# Altium project 8 Motors.PrjPcb (part 1 of 2)
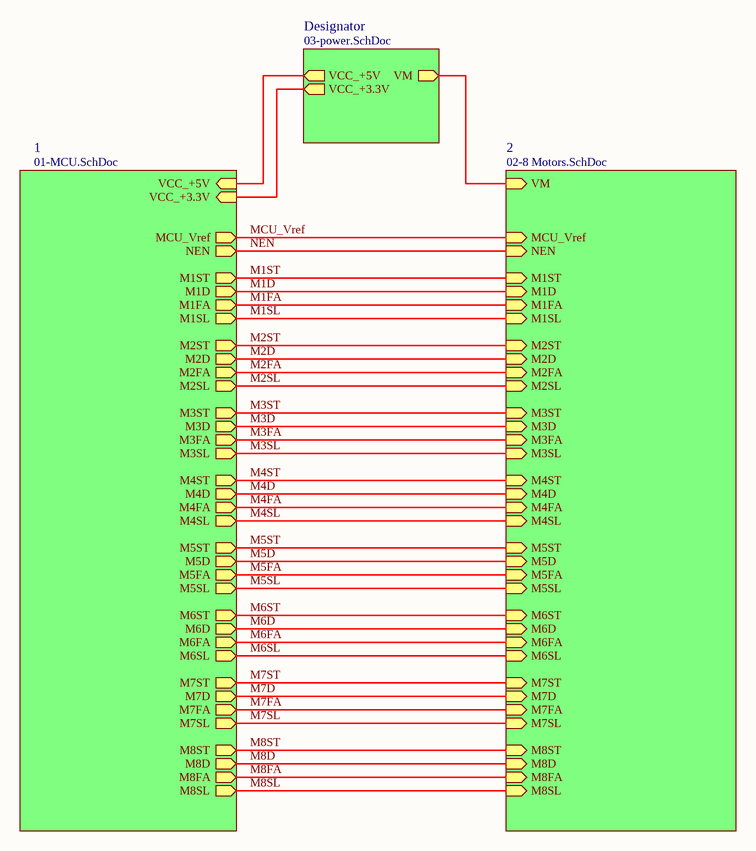
[diagram p0: 00-Main.SchDoc]
4 sheets, 196 parts. Net scope: hierarchical (ports join the sheet entries above them; power ports are global).
Board file: 8 Motors.PcbDoc
Sheets:
  00-Main.SchDoc
    1 = 01-MCU.SchDoc
    2 = 02-8 Motors.SchDoc
    Designator = 03-power.SchDoc

## Sheet 00-Main.SchDoc
size A4

### Sub-sheets
1 = 01-MCU.SchDoc: M1ST (out), M1D (out), M1FA (out), M1SL (out), NEN (out), M2ST (out), M2D (out), M2FA (out), M2SL (out), M3ST (out), M3D (out), M3FA (out), M3SL (out), M4ST (out), M4D (out), M4FA (out), M4SL (out), M5ST (out), M5D (out), M5FA (out), M5SL (out), M6ST (out), M6D (out), M6FA (out), M6SL (out), M7ST (out), M7D (out), M7FA (out), M7SL (out), M8ST (out), M8D (out), M8FA (out), M8SL (out), MCU_Vref (out), VCC_+5V (in), VCC_+3.3V (in)
2 = 02-8 Motors.SchDoc: M1ST (in), M1D (in), M1FA (in), M1SL (in), NEN (in), M2ST (in), M2D (in), M2FA (in), M2SL (in), M3ST (in), M3D (in), M3FA (in), M3SL (in), M4ST (in), M4D (in), M4FA (in), M4SL (in), M5ST (in), M5D (in), M5FA (in), M5SL (in), M6ST (in), M6D (in), M6FA (in), M6SL (in), M7ST (in), M7D (in), M7FA (in), M7SL (in), M8ST (in), M8D (in), M8FA (in), M8SL (in), MCU_Vref (in), VM (in)
Designator = 03-power.SchDoc: VCC_+5V (out), VCC_+3.3V (out), VM (out)

### Nets
VCC_+3.3V: sheet 1/VCC_+3.3V, sheet Designator/VCC_+3.3V
VCC_+5V: sheet 1/VCC_+5V, sheet Designator/VCC_+5V
VM: sheet 2/VM, sheet Designator/VM
M1D: sheet 1/M1D, sheet 2/M1D
M1FA: sheet 1/M1FA, sheet 2/M1FA
M1SL: sheet 1/M1SL, sheet 2/M1SL
M1ST: sheet 1/M1ST, sheet 2/M1ST
M2D: sheet 1/M2D, sheet 2/M2D
M2FA: sheet 1/M2FA, sheet 2/M2FA
M2SL: sheet 1/M2SL, sheet 2/M2SL
M2ST: sheet 1/M2ST, sheet 2/M2ST
M3D: sheet 1/M3D, sheet 2/M3D
M3FA: sheet 1/M3FA, sheet 2/M3FA
M3SL: sheet 1/M3SL, sheet 2/M3SL
M3ST: sheet 1/M3ST, sheet 2/M3ST
M4D: sheet 1/M4D, sheet 2/M4D
M4FA: sheet 1/M4FA, sheet 2/M4FA
M4SL: sheet 1/M4SL, sheet 2/M4SL
M4ST: sheet 1/M4ST, sheet 2/M4ST
M5D: sheet 1/M5D, sheet 2/M5D
M5FA: sheet 1/M5FA, sheet 2/M5FA
M5SL: sheet 1/M5SL, sheet 2/M5SL
M5ST: sheet 1/M5ST, sheet 2/M5ST
M6D: sheet 1/M6D, sheet 2/M6D
M6FA: sheet 1/M6FA, sheet 2/M6FA
M6SL: sheet 1/M6SL, sheet 2/M6SL
M6ST: sheet 1/M6ST, sheet 2/M6ST
M7D: sheet 1/M7D, sheet 2/M7D
M7FA: sheet 1/M7FA, sheet 2/M7FA
M7SL: sheet 1/M7SL, sheet 2/M7SL
M7ST: sheet 1/M7ST, sheet 2/M7ST
M8D: sheet 1/M8D, sheet 2/M8D
M8FA: sheet 1/M8FA, sheet 2/M8FA
M8SL: sheet 1/M8SL, sheet 2/M8SL
M8ST: sheet 1/M8ST, sheet 2/M8ST
MCU_Vref: sheet 1/MCU_Vref, sheet 2/MCU_Vref
NEN: sheet 1/NEN, sheet 2/NEN

## Sheet 01-MCU.SchDoc
size A3
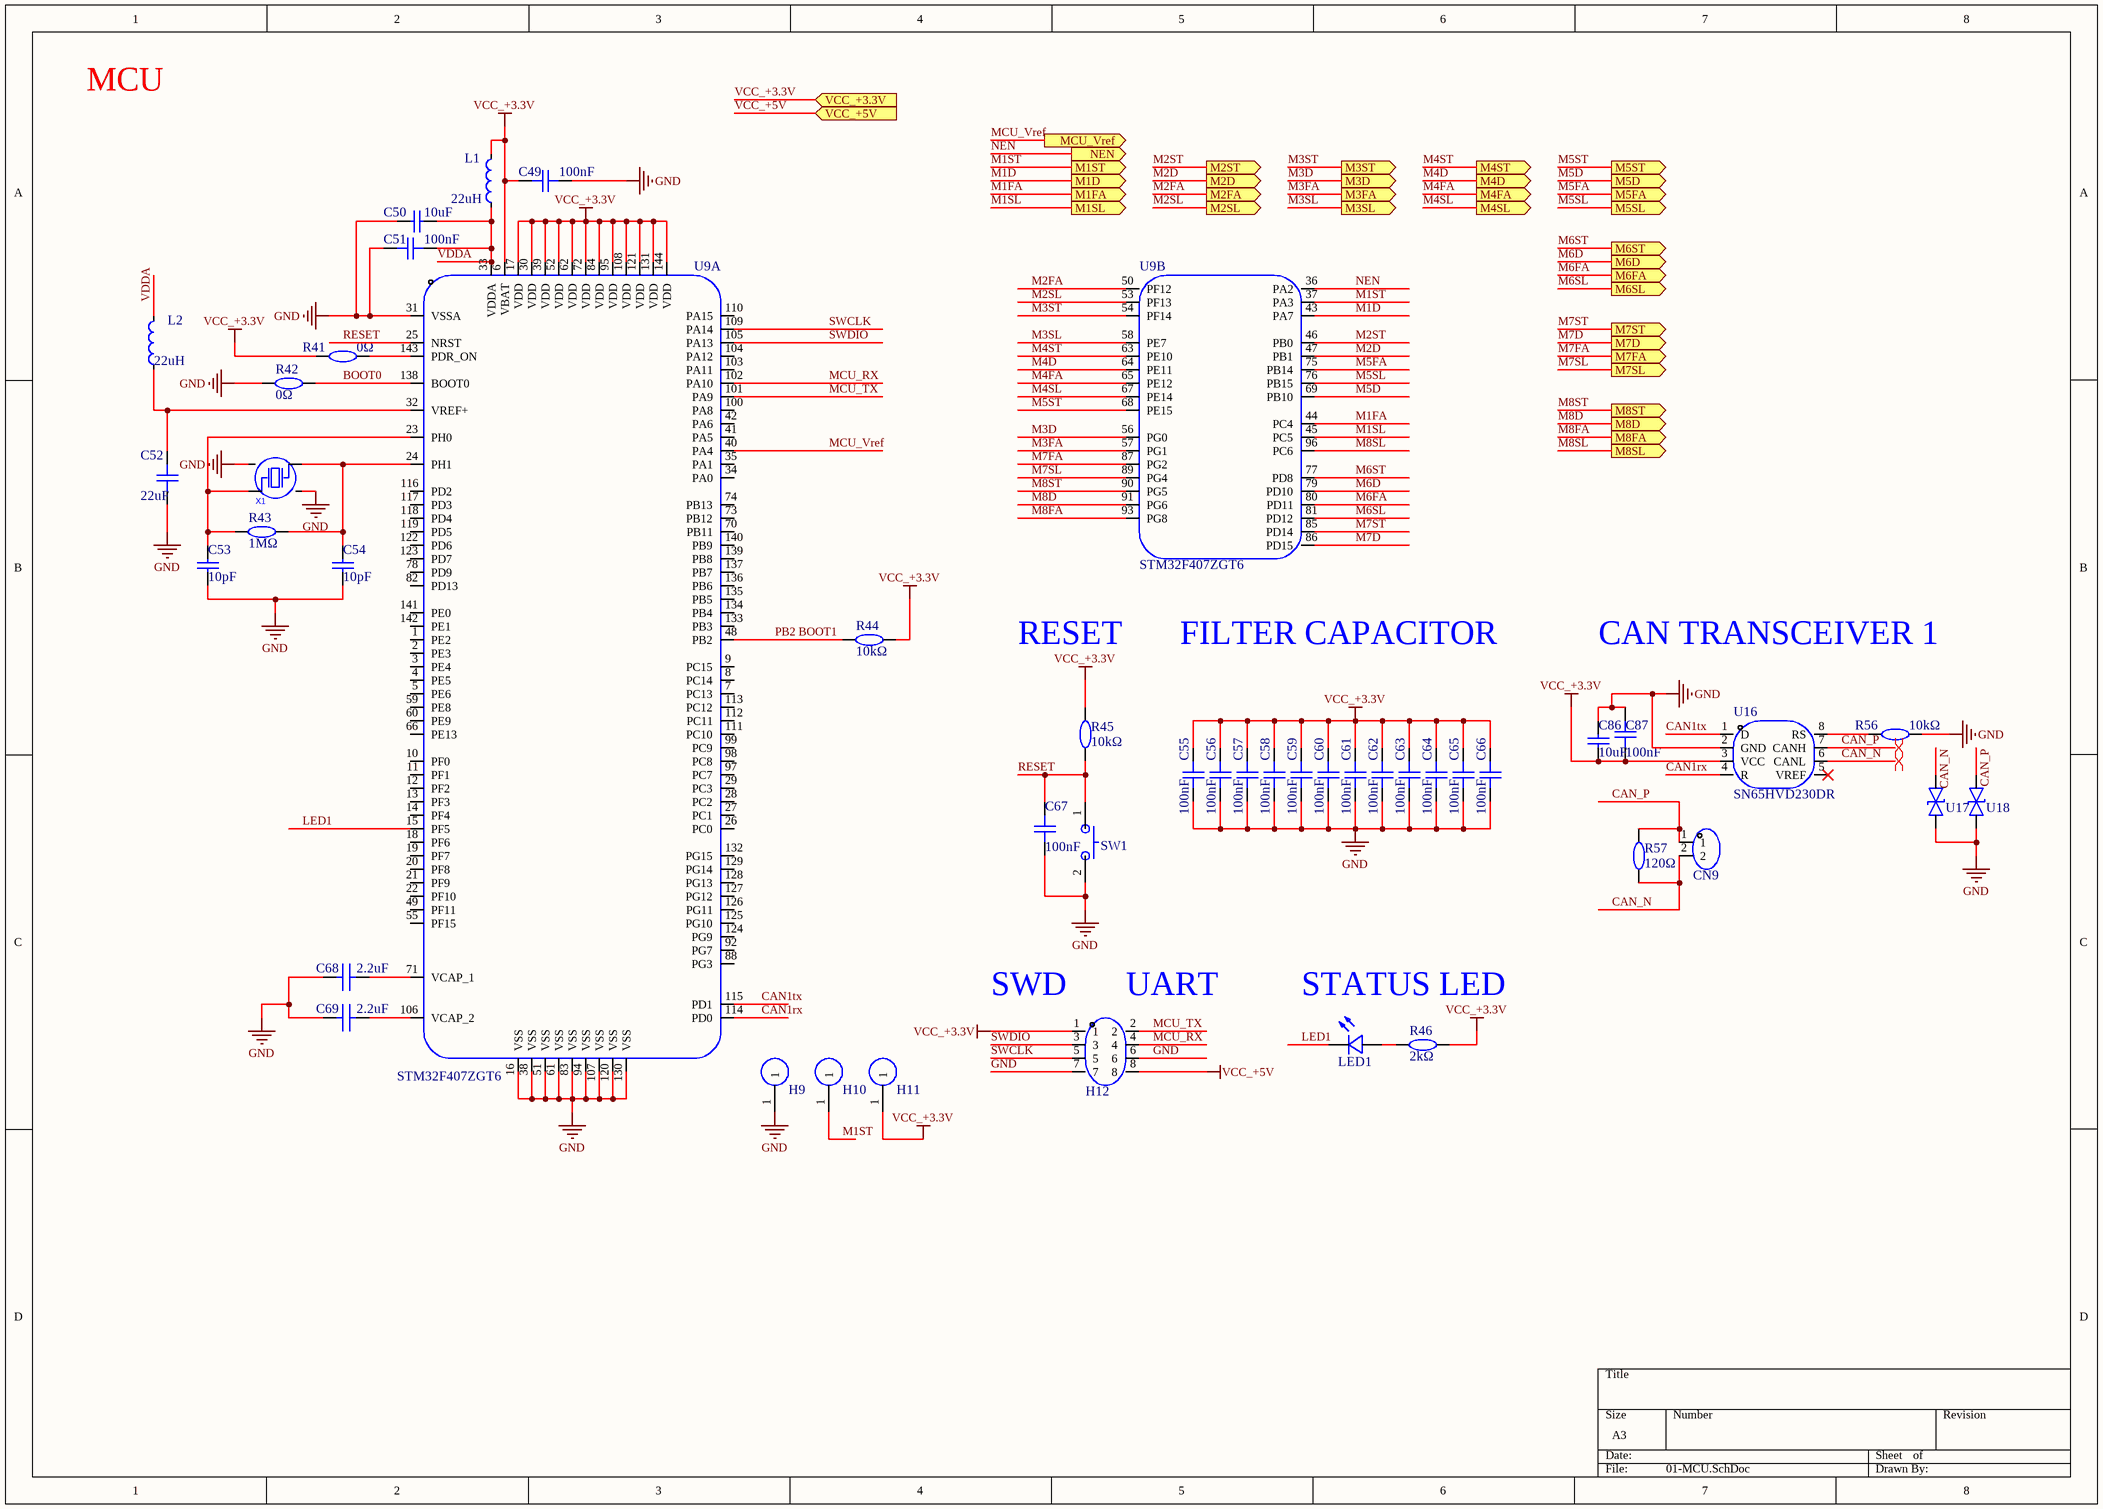
[diagram p1: 01-MCU.SchDoc]

### Parts
C49  100nF  [C0402_2.2uF]
C50  10uF  [C0402_2.2uF]
C51  100nF  [C0402_2.2uF]
C52  22uF  [C0603]
C53  10pF  [C0402_2.2uF]
C54  10pF  [C0402_2.2uF]
C55  100nF  [C0402_2.2uF]
C56  100nF  [C0402_2.2uF]
C57  100nF  [C0402_2.2uF]
C58  100nF  [C0402_2.2uF]
C59  100nF  [C0402_2.2uF]
C60  100nF  [C0402_2.2uF]
C61  100nF  [C0402_2.2uF]
C62  100nF  [C0402_2.2uF]
C63  100nF  [C0402_2.2uF]
C64  100nF  [C0402_2.2uF]
C65  100nF  [C0402_2.2uF]
C66  100nF  [C0402_2.2uF]
C67  100nF  [C0603]
C68  2.2uF  [C0402_2.2uF]
C69  2.2uF  [C0402_2.2uF]
C86  10uF  [C0402_2.2uF]
C87  100nF  [C0402_2.2uF]
CN9  ZX-XH2.54-2PZZ  [ZX-XH2.54-2PZZ]  (value not drawn)
H9  PZ254V-11-01P  [Testpoint]  (value not drawn)
H10  PZ254V-11-01P  [Testpoint]  (value not drawn)
H11  PZ254V-11-01P  [Testpoint]  (value not drawn)
H12  PZ254V-12-8P  [HC-1.25-8PLT]  (value not drawn)
L1  22uH  [L0603_22uH]
L2  22uH  [L0603_22uH]
LED1  MHT192UGCT  [LED]  (value not drawn)
R41  0Ω  [R0603]
R42  0Ω  [R0603]
R43  1MΩ  [R0603]
R44  10kΩ  [R0603_10KΩ]
R45  10kΩ  [R0603_10KΩ]
R46  2kΩ  [R0603]
R56  10kΩ  [R0603]
R57  120Ω  [R0603]
SW1  GT-TC029B-H020-L1N  [Switch]  (value not drawn)
U9  STM32F407ZGT6  [STM32F407ZGT6]  (parts A,B of 2)
U16  SN65HVD230DR  [SN65HVD230DR]
U17  PESD0603-240  [PESD0603-240]  (value not drawn)
U18  PESD0603-240  [PESD0603-240]  (value not drawn)
X1  8MHz  [Osc_8M]  (value not drawn)

### Ports
M1D (out), M1FA (out), M1SL (out), M1ST (out), M2D (out), M2FA (out), M2SL (out), M2ST (out), M3D (out), M3FA (out), M3SL (out), M3ST (out), M4D (out), M4FA (out), M4SL (out), M4ST (out), M5D (out), M5FA (out), M5SL (out), M5ST (out), M6D (out), M6FA (out), M6SL (out), M6ST (out), M7D (out), M7FA (out), M7SL (out), M7ST (out), M8D (out), M8FA (out), M8SL (out), M8ST (out), MCU_Vref (out), NEN (out), VCC_+3.3V (in), VCC_+5V (in)

### Nets
GND: C49.2 C50.1 C51.1 C52.1 C53.1 C54.1 C55.2 C56.2 C57.2 C58.2 C59.2 C60.2 C61.2 C62.2 C63.2 C64.2 C65.2 C66.2 C67.1 C68.1 C69.1 C86.2 C87.2 H9.1 H12.6 H12.7 R42.1 R56.2 SW1.2 U9.16(VSS) U9.31(VSSA) U9.38(VSS) U9.51(VSS) U9.61(VSS) U9.83(VSS) U9.94(VSS) U9.107(VSS) U9.120(VSS) U9.130(VSS) U16.2(GND) U17.1 U18.1 X1.2 X1.4
VCC_+3.3V: C49.1 C55.1 C56.1 C57.1 C58.1 C59.1 C60.1 C61.1 C62.1 C63.1 C64.1 C65.1 C66.1 C86.1 C87.1 H11.1 H12.1 L1.2 R41.1 R44.2 R45.2 R46.2 U9.6(VBAT) U9.17(VDD) U9.30(VDD) U9.39(VDD) U9.52(VDD) U9.62(VDD) U9.72(VDD) U9.84(VDD) U9.95(VDD) U9.108(VDD) U9.121(VDD) U9.131(VDD) U9.144(VDD) U16.3(VCC) ; port VCC_+3.3V
VCC_+5V: H12.8 ; port VCC_+5V
BOOT0: R42.2 U9.138(BOOT0)
CAN1rx: U9.114(PD0) U16.4(R)
CAN1tx: U9.115(PD1) U16.1(D)
CAN_N: CN9.2 R57.1 U16.6(CANL) U17.2
CAN_P: CN9.1 R57.2 U16.7(CANH) U18.2
LED1: LED1.1(-) U9.15(PF5)
M1D: U9.43(PA7) ; port M1D
M1FA: U9.44(PC4) ; port M1FA
M1SL: U9.45(PC5) ; port M1SL
M1ST: H10.1 U9.37(PA3) ; port M1ST
M2D: U9.47(PB1) ; port M2D
M2FA: U9.50(PF12) ; port M2FA
M2SL: U9.53(PF13) ; port M2SL
M2ST: U9.46(PB0) ; port M2ST
M3D: U9.56(PG0) ; port M3D
M3FA: U9.57(PG1) ; port M3FA
M3SL: U9.58(PE7) ; port M3SL
M3ST: U9.54(PF14) ; port M3ST
M4D: U9.64(PE11) ; port M4D
M4FA: U9.65(PE12) ; port M4FA
M4SL: U9.67(PE14) ; port M4SL
M4ST: U9.63(PE10) ; port M4ST
M5D: U9.69(PB10) ; port M5D
M5FA: U9.75(PB14) ; port M5FA
M5SL: U9.76(PB15) ; port M5SL
M5ST: U9.68(PE15) ; port M5ST
M6D: U9.79(PD10) ; port M6D
M6FA: U9.80(PD11) ; port M6FA
M6SL: U9.81(PD12) ; port M6SL
M6ST: U9.77(PD8) ; port M6ST
M7D: U9.86(PD15) ; port M7D
M7FA: U9.87(PG2) ; port M7FA
M7SL: U9.89(PG4) ; port M7SL
M7ST: U9.85(PD14) ; port M7ST
M8D: U9.91(PG6) ; port M8D
M8FA: U9.93(PG8) ; port M8FA
M8SL: U9.96(PC6) ; port M8SL
M8ST: U9.90(PG5) ; port M8ST
MCU_RX: H12.4 U9.102(PA10)
MCU_TX: H12.2 U9.101(PA9)
MCU_Vref: U9.40(PA4) ; port MCU_Vref
NEN: U9.36(PA2) ; port NEN
PB2 BOOT1: R44.1 U9.48(PB2)
RESET: C67.2 R45.1 SW1.1 U9.25(NRST)
SWCLK: H12.5 U9.109(PA14)
SWDIO: H12.3 U9.105(PA13)
VDDA: C50.2 C51.2 L1.1 L2.2 U9.33(VDDA)
NetC52_2: C52.2 L2.1 U9.32(VREF+)
NetC53_2: C53.2 R43.1 U9.23(PH0) X1.1
NetC54_2: C54.2 R43.2 U9.24(PH1) X1.3
NetC68_2: C68.2 U9.71(VCAP_1)
NetC69_2: C69.2 U9.106(VCAP_2)
NetLED1_2: LED1.2(+) R46.1
NetR41_2: R41.2 U9.143(PDR_ON)
NetR56_1: R56.1 U16.8(RS)

Not connected (* = marked no-connect by the designer): U9 1(PE2) 2(PE3) 3(PE4) 4(PE5) 5(PE6) 7(PC13) 8(PC14) 9(PC15) 10(PF0) 11(PF1) 12(PF2) 13(PF3) 14(PF4) 18(PF6) 19(PF7) 20(PF8) 21(PF9) 22(PF10) 26(PC0) 27(PC1) 28(PC2) 29(PC3) 34(PA0) 35(PA1) 41(PA5) 42(PA6) 49(PF11) 55(PF15) 59(PE8) 60(PE9) 66(PE13) 70(PB11) 73(PB12) 74(PB13) 78(PD9) 82(PD13) 88(PG3) 92(PG7) 97(PC7) 98(PC8) 99(PC9) 100(PA8) 103(PA11) 104(PA12) 110(PA15) 111(PC10) 112(PC11) 113(PC12) 116(PD2) 117(PD3) 118(PD4) 119(PD5) 122(PD6) 123(PD7) 124(PG9) 125(PG10) 126(PG11) 127(PG12) 128(PG13) 129(PG14) 132(PG15) 133(PB3) 134(PB4) 135(PB5) 136(PB6) 137(PB7) 139(PB8) 140(PB9) 141(PE0) 142(PE1); U16 5(VREF)*

### Layout directives
differential pair: CAN_N, CAN_P

### Notes on the sheet
- MCU
- RESET
- FILTER CAPACITOR
- CAN TRANSCEIVER 1
- (near H12) SWD
- (near H12) UART
- STATUS LED

### Library data of the parts
C49 C51 C55-C66 C87 = C0402_100nF: 0402电容; Manufacturer: muRata(村田); Symbol: GRM155R71H104KE14D; Add into BOM: yes; Tolerance: ±10%; Voltage Rated: 50V; Temperature Coefficient: X7R; Device: GRM155R71H104KE14D; LCSC Part Name: 100nF ±10% 50V; Supplier Part: C77020; Manufacturer Part: GRM155R71H104KE14D; Supplier Footprint: 0402; JLCPCB Part Class: Extended Part; Datasheet: https://atta.szlcsc.com/upload/public/pdf/source/20180326/C77020_39BD49C951FF1AF0DB1F1FAC5AC1E401.pdf; Supplier: LCSC; Convert to PCB: yes; Value: 100nF; Comment_1: 100nF
C50 C86 = C0402_10uF: 0402电容; Manufacturer: SAMSUNG(三星); Symbol: CL05A106MQ5NUNC; Add into BOM: yes; Tolerance: ±20%; Voltage Rated: 6.3V; Temperature Coefficient: X5R; Device: CL05A106MQ5NUNC; LCSC Part Name: 10uF ±20% 6.3V; Supplier Part: C15525; Manufacturer Part: CL05A106MQ5NUNC; Supplier Footprint: 0402; JLCPCB Part Class: Basic Part; Datasheet: https://atta.szlcsc.com/upload/public/pdf/source/20220823/2B02EE04F8F211D38A52DCB16EB6BEBA.pdf; Supplier: LCSC; Convert to PCB: yes; Value: 10uF; Comment_1: 10uF
C52 = C0603_22uF: 0603电容; Manufacturer: SAMSUNG(三星); Symbol: CC0603KRX7R9BB104; Add into BOM: yes; Tolerance: ±20%; Voltage Rated: 16V; Temperature Coefficient: X5R; Name: 22uF; Device: CC0603KRX7R9BB104; LCSC Part Name: 22uF ±20% 16V; Supplier Part: C6119868; Manufacturer Part: CC0603KRX7R9BB104; Supplier Footprint: 0603; JLCPCB Part Class: Basic Part; Datasheet: https://atta.szlcsc.com/upload/public/pdf/source/20180910/C282072_33301C7F631E79921B82A8DAC6BCC5B3.pdf; Supplier: LCSC; Convert to PCB: yes; Value: 22uF
C53 C54 = C0402_10pF: 0402电容; Manufacturer: FH(风华); Symbol: 0402CG100J500NT; Add into BOM: yes; Tolerance: ±5%; Voltage Rated: 50V; Temperature Coefficient: C0G; Device: 0402CG100J500NT; LCSC Part Name: 10pF ±5% 50V; Supplier Part: C1545; Manufacturer Part: 0402CG100J500NT; Supplier Footprint: 0402; JLCPCB Part Class: Extended Part; Datasheet: https://atta.szlcsc.com/upload/public/pdf/source/20200305/C486355_26A10D38EF8C2A5C37091D0039909270.pdf; Supplier: LCSC; Convert to PCB: yes; Value: 10pF; Comment_1: 10pF
C67 = C0603_100nF: 0603电容; Manufacturer: SAMSUNG(三星); Symbol: CC0603KRX7R9BB104; Add into BOM: yes; Tolerance: ±10%; Voltage Rated: 50V; Temperature Coefficient: X7R; Name: 100nF; Device: CC0603KRX7R9BB104; LCSC Part Name: 100nF ±10% 50V; Supplier Part: C6119867; Manufacturer Part: CC0603KRX7R9BB104; Supplier Footprint: 0603; JLCPCB Part Class: Basic Part; Datasheet: https://atta.szlcsc.com/upload/public/pdf/source/20180910/C282072_33301C7F631E79921B82A8DAC6BCC5B3.pdf; Supplier: LCSC; Convert to PCB: yes; Value: 100nF
C68 C69 = C0402_2.2uF: 容值 2.2uF   精度 ±20%   额定电压 6.3V   材质(温度系数) X5R; Manufacturer: SAMSUNG(三星); Symbol: CL05A225MQ5NSNC; Add into BOM: yes; Device: CL05A225MQ5NSNC; LCSC Part Name: 2.2uF ±20% 6.3V; Supplier Part: C12530; Manufacturer Part: CL05A225MQ5NSNC; Supplier Footprint: 0402; JLCPCB Part Class: Basic Part; Datasheet: https://atta.szlcsc.com/upload/public/pdf/source/20160218/1457707763339.pdf; Supplier: LCSC; Convert to PCB: yes; Value: 2.2uF; Tolerance: ±20%; Voltage Rated: 6.3V; Temperature Coefficient: X5R; Comment_1: 2.2uF
CN9 = ZX-XH2.54-2PZZ: 直插插针; Manufacturer: Megastar(兆星); Add into BOM: yes; Pins Structure: 1x2P; Pitch: 2.54mm; Reference Series: XH; Number of PINs Per Row: 2; Current Rating (Max): 3A; Symbol: ZX-XH2.54-2PZZ; Device: ZX-XH2.54-2PZZ; LCSC Part Name: ZX-XH2.54-2PZZ; Supplier Part: C7429632; Manufacturer Part: ZX-XH2.54-2PZZ; Supplier Footprint: 插件,P=2.54mm; JLCPCB Part Class: Extended Part; Datasheet: https://atta.szlcsc.com/upload/public/pdf/source/20230619/19BA6947230AA44A04D3EDD65E618FD0.pdf; Supplier: LCSC; Convert to PCB: yes; Mounting Style: 直插; Number of Pins: 2P; Number of Rows: 1; Row Spacing: -; Contact Material: 黄铜; Contact Plating: 锡; Operating Temperature Range: -25℃~+85℃; Comment_1: ZX-XH2.54-2PZZ
H9-H11 = Testpoint: 测试点; Manufacturer: XFCN(兴飞); Add into BOM: yes; Pin Structure: 1x1P; Pitch: 2.54mm; Circluar Pins/Square Pins: 方针; Symbol: PZ254V-11-01P; Device: PZ254V-11-01P; LCSC Part Name: 间距:2.54mm 1x1P 直插 方针; Supplier Part: C492400; Manufacturer Part: PZ254V-11-01P; Supplier Footprint: 插件,P=2.54mm; JLCPCB Part Class: Extended Part; Datasheet: https://atta.szlcsc.com/upload/public/pdf/source/20200309/C492400_46876A5B545F5AE6B8D4A09C46E276E8.pdf; Supplier: LCSC; Convert to PCB: yes; Row Spacing: -; Mounting Type: 直插; Number of Rows: 单排; Number of Pins: 1P; Current Rating (Max): -; Voltage Rating (Max): -; Length of Mating Pin: 6mm; Insulation Height: 2.5mm; Length of End Connection Pin: 3mm; Contact Material: 黄铜; Contact Plating: -; Operating Temperature Range: -40℃~+105℃; Color: 黑色; Comment_1: PZ254V-11-01P
H12 = HC-1.25-8PLT: 排针8P; Manufacturer: XFCN(兴飞); Add into BOM: yes; Pin Structure: 2x4P; Pitch: 2.54mm; Circluar Pins/Square Pins: 方针; Symbol: PZ254V-12-8P; Device: PZ254V-12-8P; LCSC Part Name: 间距:2.54mm 2x4P 直插 方针; Supplier Part: C492421; Manufacturer Part: PZ254V-12-8P; Supplier Footprint: 插件,P=2.54mm; JLCPCB Part Class: Extended Part; Datasheet: https://atta.szlcsc.com/upload/public/pdf/source/20200309/C492421_DC8A206AF99CD7755BD4A5B0BC48200B.pdf; Supplier: LCSC; Convert to PCB: yes; Row Spacing: 2.54mm; Mounting Type: 直插; Number of Rows: 双排; Number of Pins: 8P; Current Rating (Max): -; Voltage Rating (Max): -; Length of Mating Pin: 6mm; Insulation Height: 2.5mm; Length of End Connection Pin: 3mm; Contact Material: 黄铜; Contact Plating: -; Operating Temperature Range: -40℃~+105℃; Color: 黑色; Comment_1: PZ254V-12-8P
L1 L2 = L0603_22uH: 0603电感; Manufacturer: TDK; Symbol: MLZ1608M220WT000; Add into BOM: yes; Tolerance: ±20%; Saturation Current (Isat): 55mA; DC Resistance (DCR): 2.4Ω; Device: MLZ1608M220WT000; LCSC Part Name: 22uH ±20% 55mA; Supplier Part: C383393; Manufacturer Part: MLZ1608M220WT000; Supplier Footprint: 0603; JLCPCB Part Class: Extended Part; Datasheet: https://atta.szlcsc.com/upload/public/pdf/source/20160918/1474166926388.pdf; Supplier: LCSC; Convert to PCB: yes; Value: 22uH; Rated Current: -; Q @ Freq: -; Frequency - Self Resonant: -; Ratings: -; Comment_1: 22uH
LED1 = LED: 发光二极管 绿色; Manufacturer: MEIHUA(美华); Add into BOM: yes; Emitted Color: 翠绿色; Power Dissipation: 60mW; Forward Current: 20mA; Dominant Wavelength: 515nm~530nm; Peak Wavelength: 518nm; Lens Color: 无色透明透镜; Viewing Angle: 120°; Symbol: MHT192UGCT; Device: MHT192UGCT; LCSC Part Name: 翠绿; Supplier Part: C389519; Manufacturer Part: MHT192UGCT; Supplier Footprint: 0603; JLCPCB Part Class: Extended Part; Datasheet: https://atta.szlcsc.com/upload/public/pdf/source/20190515/C389519_7BC27E831414348C8AF19AF18EE4BF58.pdf; Supplier: LCSC; Convert to PCB: yes; Diode Configuration: -; Color Temperature: -; Mounting Sytle: -; Operating Temperature: -40℃~+85℃; Comment_1: MHT192UGCT
R41 R42 = R0603_0Ω: 阻值 0Ω   精度 ±1%   功率 100mW   最大工作电压 75V   工作温度范围 -55℃~+155℃; Manufacturer: UNI-ROYAL(厚声); Symbol: 0603WAF0000T5E; Add into BOM: yes; Device: 0603WAF0000T5E; LCSC Part Name: 0Ω ±1% 100mW 厚膜电阻; Supplier Part: C21189; Manufacturer Part: 0603WAF0000T5E; Supplier Footprint: 0603; JLCPCB Part Class: Basic Part; Datasheet: https://atta.szlcsc.com/upload/public/pdf/source/20200306/C422600_1E6D84923E4A46A82E41ADD87F860B5C.pdf; Supplier: LCSC; Convert to PCB: yes; Type: 厚膜电阻; Value: 0Ω; Tolerance: ±1%; Power(Watts): 100mW; Overload Voltage (Max): 75V; Operating Temperature Range: -55℃~+155℃; Comment_1: 0Ω
R43 = R0603_1MΩ: 0603电阻; Manufacturer: UNI-ROYAL(厚声); Symbol: 0603WAF5100T5E; Add into BOM: yes; Tolerance: ±1%; Power(Watts): 100mW; Overload Voltage (Max): 75V; Temperature Coefficient: ±100ppm/℃; Name: 1MΩ; Device: 0603WAF5100T5E; LCSC Part Name: 1MΩ ±1% 100mW 厚膜电阻; Supplier Part: C22935; Manufacturer Part: 0603WAF5100T5E; Supplier Footprint: 0603; JLCPCB Part Class: Basic Part; Datasheet: https://atta.szlcsc.com/upload/public/pdf/source/20200306/C422600_1E6D84923E4A46A82E41ADD87F860B5C.pdf; Supplier: LCSC; Convert to PCB: yes; Type: 厚膜电阻; Value: 1MΩ; Operating Temperature Range: -55℃~+155℃
R44 R45 R56 = R0603_10KΩ: 0603电阻; Manufacturer: UNI-ROYAL(厚声); Symbol: 0603WAF1002T5E; Add into BOM: yes; Tolerance: ±1%; Power(Watts): 100mW; Overload Voltage (Max): 75V; Temperature Coefficient: ±100ppm/℃; Device: 0603WAF1002T5E; LCSC Part Name: 厚膜电阻 10kΩ ±1% 100mW; Supplier Part: C25804; Manufacturer Part: 0603WAF1002T5E; Supplier Footprint: 0603; JLCPCB Part Class: Basic Part; Datasheet: https://atta.szlcsc.com/upload/public/pdf/source/20200306/C422600_1E6D84923E4A46A82E41ADD87F860B5C.pdf; Supplier: LCSC; Convert to PCB: yes; Type: 厚膜电阻; Value: 10kΩ; Operating Temperature Range: -55℃~+155℃; Comment_1: 10kΩ
R46 = R0603_2KΩ: 0603电阻; Manufacturer: UNI-ROYAL(厚声); Symbol: 0603WAF2001T5E; Add into BOM: yes; Tolerance: ±1%; Power(Watts): 100mW; Overload Voltage (Max): 75V; Temperature Coefficient: ±100ppm/℃; Device: 0603WAF2001T5E; LCSC Part Name: 2kΩ ±1% 100mW 厚膜电阻; Supplier Part: C22975; Manufacturer Part: 0603WAF2001T5E; Supplier Footprint: 0603; JLCPCB Part Class: Basic Part; Datasheet: https://atta.szlcsc.com/upload/public/pdf/source/20200306/C422600_1E6D84923E4A46A82E41ADD87F860B5C.pdf; Supplier: LCSC; Convert to PCB: yes; Type: 厚膜电阻; Value: 2kΩ; Operating Temperature Range: -55℃~+155℃; Comment_1: 2kΩ
R57 = R0603_120Ω: 0603电阻; Manufacturer: UNI-ROYAL(厚声); Symbol: 0603WAF1200T5E; Add into BOM: yes; Tolerance: ±1%; Power(Watts): 100mW; Overload Voltage (Max): 75V; Temperature Coefficient: ±100ppm/℃; Device: 0603WAF1200T5E; LCSC Part Name: 120Ω ±1% 100mW 厚膜电阻; Supplier Part: C22787; Manufacturer Part: 0603WAF1200T5E; Supplier Footprint: 0603; JLCPCB Part Class: Basic Part; Datasheet: https://atta.szlcsc.com/upload/public/pdf/source/20200306/C422600_1E6D84923E4A46A82E41ADD87F860B5C.pdf; Supplier: LCSC; Convert to PCB: yes; Type: 厚膜电阻; Value: 120Ω; Operating Temperature Range: -55℃~+155℃; Comment_1: 120Ω
SW1 = Switch: 轻触开关   电路结构 单刀单掷   按钮形状 圆形按钮   作用力 2.5N   安装方式 立贴   开关长度 3.9mm   开关宽度 2.9mm   开关高度 2mm   带支架 不带   触点电流 50mA   额定电压(DC) 12V; Manufacturer: G-Switch(品赞); Add into BOM: yes; Insulation Resistance: 100MΩ; Actuator/Cap Color: 黑色; With Lamp: 无; Pin Style: SMD接片; Mechanical Life: 10万次; Symbol: GT-TC029B-H020-L1N; Device: GT-TC029B-H020-L1N; LCSC Part Name: 3.9*2.9*2mm 立贴 轻触开关; Supplier Part: C843665; Manufacturer Part: GT-TC029B-H020-L1N; Supplier Footprint: SMD; JLCPCB Part Class: Extended Part; Datasheet: https://atta.szlcsc.com/upload/public/pdf/source/20231124/F8327E72251744D4A6AAF7192EF342CB.pdf; Supplier: LCSC; Convert to PCB: yes; Circuit: 单刀单掷; Actuator Style: 圆形按钮; Operating Force: 2.5N; Mounting Style: 立贴; Switch Length: 3.9mm; Switch Width: 2.9mm; Switch Height: 2mm; Strike Gundam: 不带; Contact Current: 50mA; Voltage Rating (DC): 12V; Operating Temperature: -30℃~+85℃; Comment_1: GT-TC029B-H020-L1N
U9 = STM32F407ZGT6: CPU内核：ARM-M4  程序存储容量：1MB  RAM总容量：192KB  GPIO端口数量：114  工作电压范围：1.8V~3.6V  CPU最大主频：168MHz  程序存储器类型：FLASH  工作温度范围：-40℃~+85℃  ADC(位数)：12bit  DAC(位数)：12bit; Manufacturer: ST(意法半导体); Add into BOM: yes; CPU Core: ARM-M4; Program Storage Size: 1MB; RAM Size: 192KB; GPIO Ports Number: 114; CPU Maximum Speed: 168MHz; Program Memory Type: FLASH; ADC (Bit): 12bit; Universal Serial Bus: 有; Peripheral/Function: DMA；LCD/LED驱动; Symbol: STM32F407ZGT6; Device: STM32F407ZGT6; LCSC Part Name: 带DSP和FPU的高性能基础系列ARM Cortex-M4 MCU，具有1 MB Flash、168 MHz CPU、ART加速器、以太网和FSMC; Supplier Part: C19156; Manufacturer Part: STM32F407ZGT6; Supplier Footprint: LQFP-144(20x20); JLCPCB Part Class: Extended Part; Datasheet: https://atta.szlcsc.com/upload/public/pdf/source/20140801/1457707197138.pdf; Supplier: LCSC; Convert to PCB: yes; Operating Voltage Range: 1.8V~3.6V; Operating Temperature Range: -40℃~+85℃; DAC (Bit): 12bit; PWM (Bit): -; Internal Comparator: -; communication protocol: -; Watchdog: 有; Real-Time Clock: -; Infrared Data Association: 有; Low-Voltage Detect: 有; CCP Capture/Compare: -; LCD Module: 有; Secure Digital Input and Output: -; Direct Memory Access: 有; Internal Oscillator: 有; Comment_1: STM32F407ZGT6
U16 = SN65HVD230DR: CAN收发器; Manufacturer: TI(德州仪器); Add into BOM: yes; Data Rate: 1Mbps; Supply Voltage: 3V~3.6V; Symbol: SN65HVD230DR; Device: SN65HVD230DR; LCSC Part Name: 1Mbps 3V~3.6V; Supplier Part: C12084; Manufacturer Part: SN65HVD230DR; Supplier Footprint: SOIC-8; JLCPCB Part Class: Extended Part; Datasheet: https://www.ti.com/cn/lit/gpn/sn65hvd230; Supplier: LCSC; Convert to PCB: yes; Type: 收发器; Operating Temperature: -40℃~+85℃; Comment_1: SN65HVD230DR
U17 U18 = PESD0603-240: ESD; Manufacturer: Littelfuse(美国力特); Symbol: PESD0603-240_C2929617; Add into BOM: yes; Maximum Clamping Voltage: 45V; Number of Lines: 单路; Device: PESD0603-240_C2929617; LCSC Part Name: PESD0603-240; Supplier Part: C2929617; Manufacturer Part: PESD0603-240; Supplier Footprint: 0603; JLCPCB Part Class: Extended Part; Datasheet: https://atta.szlcsc.com/upload/public/pdf/source/20180516/C207186_7CE2F9DCABF8CE4AA3105E54FFDB24F6.pdf; Supplier: LCSC; Convert to PCB: yes; Breakdown Voltage: -; Type: ESD; Comment_1: PESD0603-240
X1 = Osc_8M: 8Mhz晶振; Manufacturer: YJX(雅晶鑫); Symbol: TAXM8M4RDBCCT2T; Add into BOM: yes; Crystal Type: 贴片晶振; Normal temperature Frequency Tolerance: ±10ppm; External load capacitor: 10pF; Frequency Stability(Full temperature range): ±15ppm; Equivalent Series Resistance (ESR): 250Ω; Device: TAXM8M4RDBCCT2T; LCSC Part Name: 8MHz ±10ppm 10pF; Supplier Part: C400090; Manufacturer Part: TAXM8M4RDBCCT2T; Supplier Footprint: SMD3225-4P; JLCPCB Part Class: Extended Part; Datasheet: https://atta.szlcsc.com/upload/public/pdf/source/20190626/C400090_CF95B89E745AFE4EF2E392EF8AC009D6.pdf; Supplier: LCSC; Convert to PCB: yes; Value: 8MHz; Operating Temperature: -40℃~+85℃; Comment_1: 8MHz

## Sheet 02-8 Motors.SchDoc: 8 Motors
size A3; Date: 2024-8-22; SheetNumber: 02; SheetTotal: 03
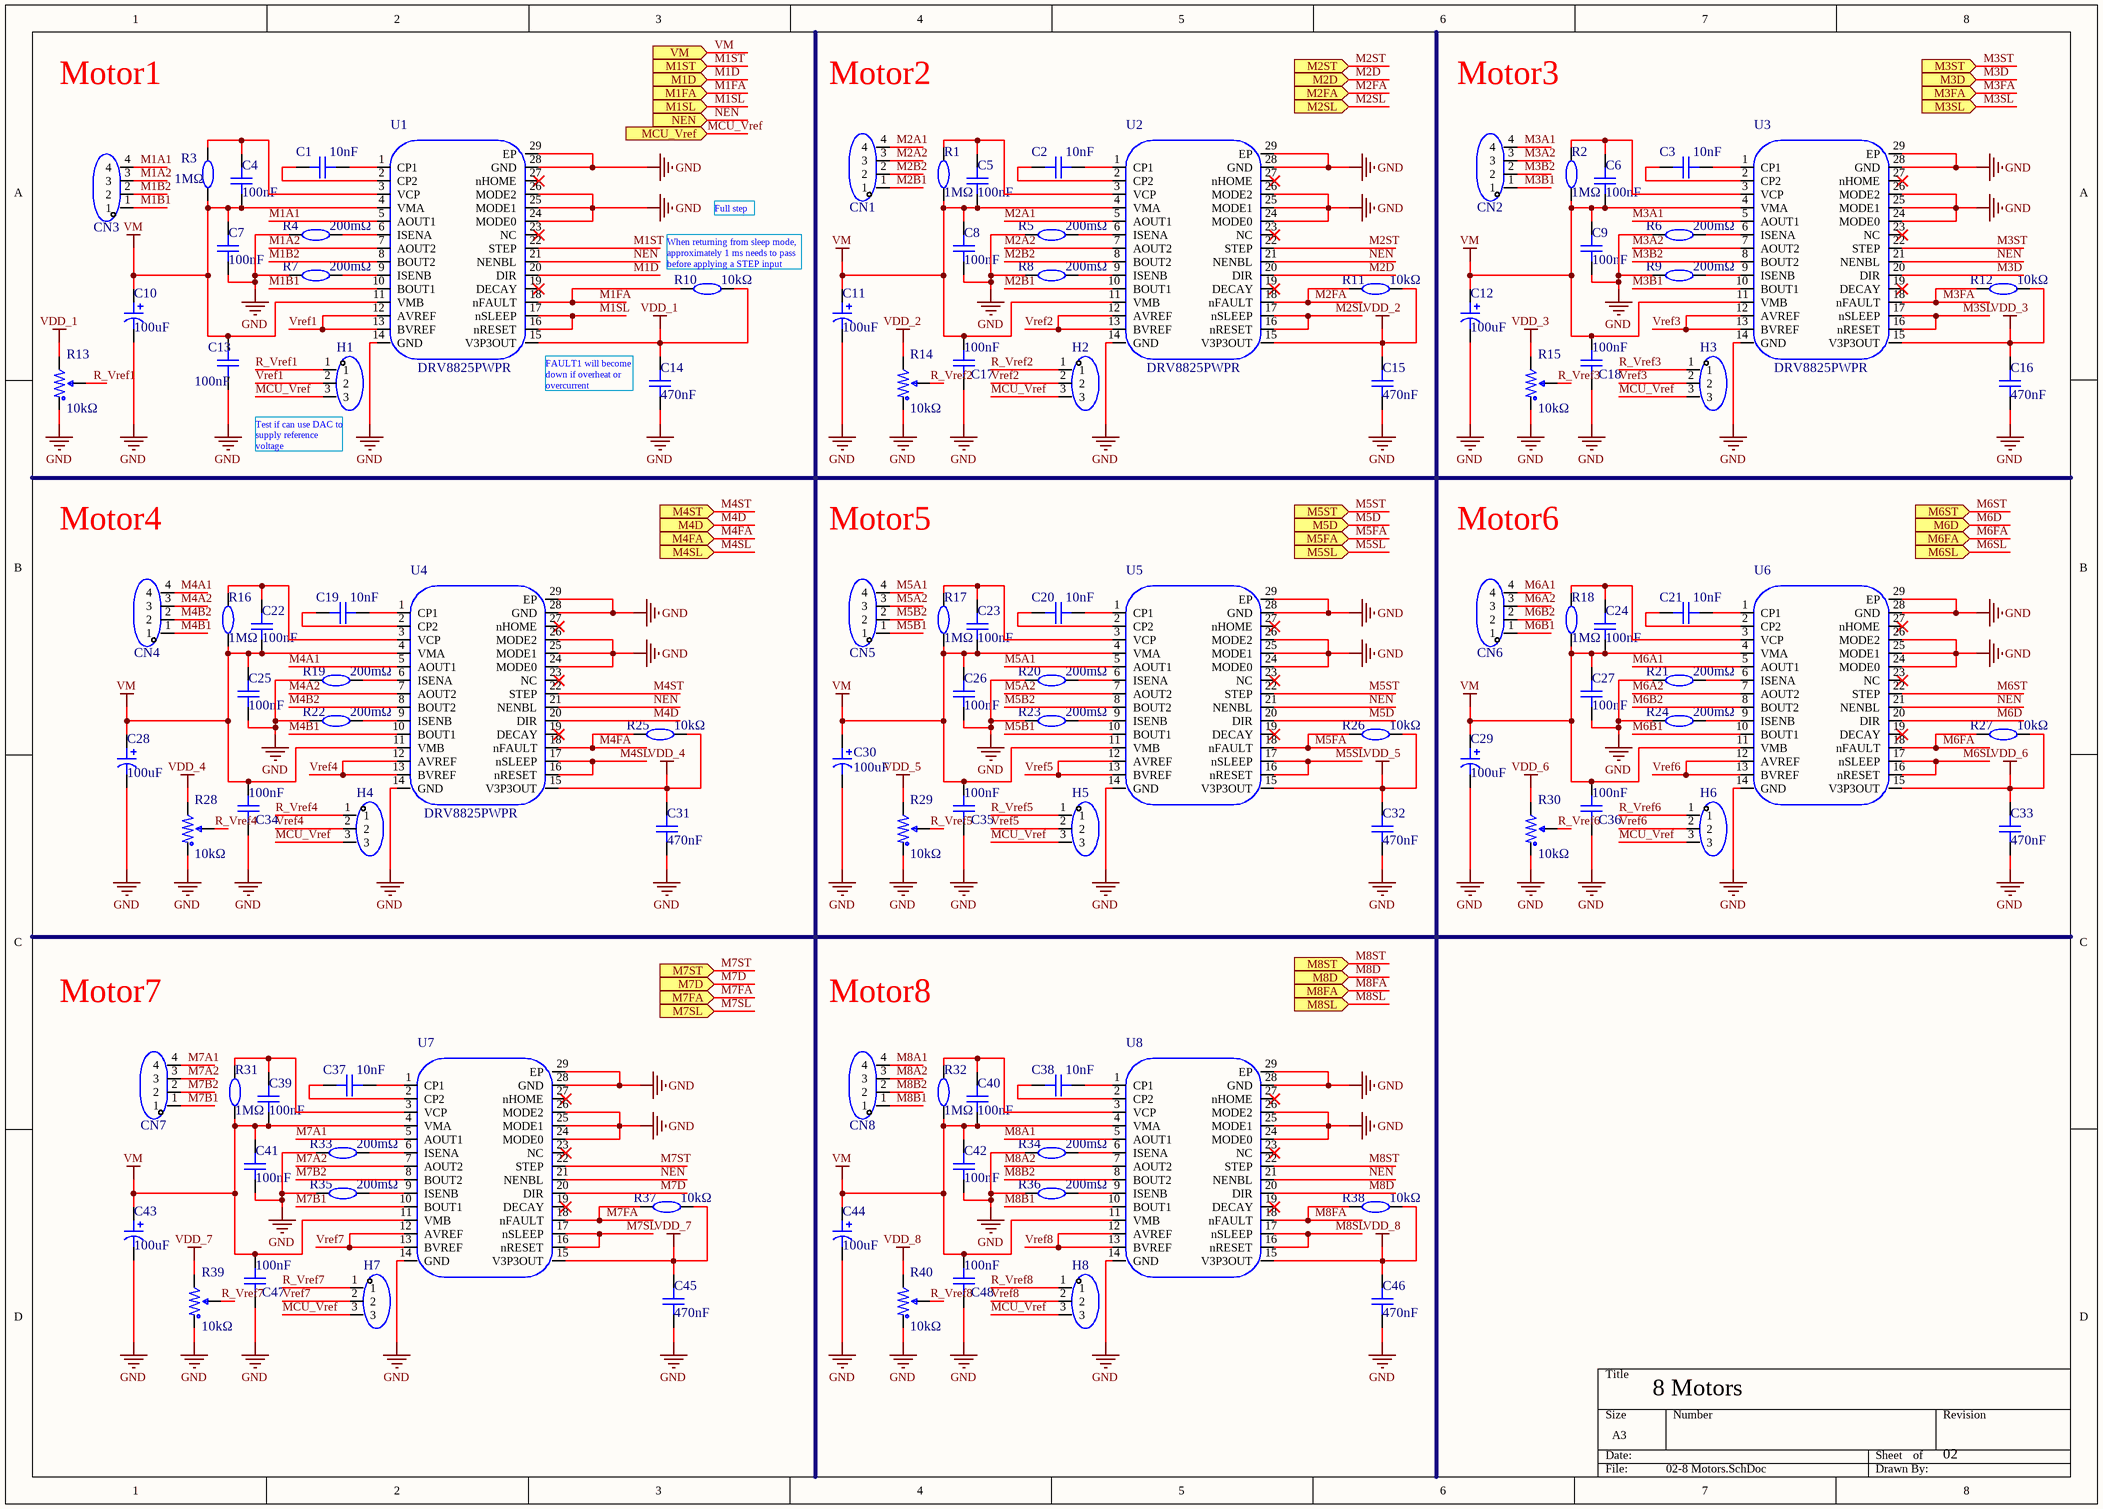
[diagram p2: 02-8 Motors.SchDoc]

### Parts
C1  10nF  [C0603]
C2  10nF  [C0603]
C3  10nF  [C0603]
C4  100nF  [C0603]
C5  100nF  [C0603]
C6  100nF  [C0603]
C7  100nF  [C0603]
C8  100nF  [C0603]
C9  100nF  [C0603]
C10  100uF  [SMD6.3_7.7_100uF]
C11  100uF  [SMD6.3_7.7_100uF]
C12  100uF  [SMD6.3_7.7_100uF]
C13  100nF  [C0603]
C14  470nF  [C0603]
C15  470nF  [C0603]
C16  470nF  [C0603]
C17  100nF  [C0603]
C18  100nF  [C0603]
C19  10nF  [C0603]
C20  10nF  [C0603]
C21  10nF  [C0603]
C22  100nF  [C0603]
C23  100nF  [C0603]
C24  100nF  [C0603]
C25  100nF  [C0603]
C26  100nF  [C0603]
C27  100nF  [C0603]
C28  100uF  [SMD6.3_7.7_100uF]
C29  100uF  [SMD6.3_7.7_100uF]
C30  100uF  [SMD6.3_7.7_100uF]
C31  470nF  [C0603]
C32  470nF  [C0603]
C33  470nF  [C0603]
C34  100nF  [C0603]
C35  100nF  [C0603]
C36  100nF  [C0603]
C37  10nF  [C0603]
C38  10nF  [C0603]
C39  100nF  [C0603]
C40  100nF  [C0603]
C41  100nF  [C0603]
C42  100nF  [C0603]
C43  100uF  [SMD6.3_7.7_100uF]
C44  100uF  [SMD6.3_7.7_100uF]
C45  470nF  [C0603]
C46  470nF  [C0603]
C47  100nF  [C0603]
C48  100nF  [C0603]
CN1  ZX-XH2.54-4PZZ  [ZX-XH2.54-4PZZ]  (value not drawn)
CN2  ZX-XH2.54-4PZZ  [ZX-XH2.54-4PZZ]  (value not drawn)
CN3  ZX-XH2.54-4PZZ  [ZX-XH2.54-4PZZ]  (value not drawn)
CN4  ZX-XH2.54-4PZZ  [ZX-XH2.54-4PZZ]  (value not drawn)
CN5  ZX-XH2.54-4PZZ  [ZX-XH2.54-4PZZ]  (value not drawn)
CN6  ZX-XH2.54-4PZZ  [ZX-XH2.54-4PZZ]  (value not drawn)
CN7  ZX-XH2.54-4PZZ  [ZX-XH2.54-4PZZ]  (value not drawn)
CN8  ZX-XH2.54-4PZZ  [ZX-XH2.54-4PZZ]  (value not drawn)
H1  PZ254V-11-03P  [HC-1.25-3PLT]  (value not drawn)
H2  PZ254V-11-03P  [HC-1.25-3PLT]  (value not drawn)
H3  PZ254V-11-03P  [HC-1.25-3PLT]  (value not drawn)
H4  PZ254V-11-03P  [HC-1.25-3PLT]  (value not drawn)
H5  PZ254V-11-03P  [HC-1.25-3PLT]  (value not drawn)
H6  PZ254V-11-03P  [HC-1.25-3PLT]  (value not drawn)
H7  PZ254V-11-03P  [HC-1.25-3PLT]  (value not drawn)
H8  PZ254V-11-03P  [HC-1.25-3PLT]  (value not drawn)
R1  1MΩ  [R0603]
R2  1MΩ  [R0603]
R3  1MΩ  [R0603]
R4  200mΩ  [R1206_200mΩ]
R5  200mΩ  [R1206_200mΩ]
R6  200mΩ  [R1206_200mΩ]
R7  200mΩ  [R1206_200mΩ]
R8  200mΩ  [R1206_200mΩ]
R9  200mΩ  [R1206_200mΩ]
R10  10kΩ  [R0603_10KΩ]
R11  10kΩ  [R0603_10KΩ]
R12  10kΩ  [R0603_10KΩ]
R13  10kΩ  [R10k_KT]
R14  10kΩ  [R10k_KT]
R15  10kΩ  [R10k_KT]
R16  1MΩ  [R0603]
R17  1MΩ  [R0603]
R18  1MΩ  [R0603]
R19  200mΩ  [R1206_200mΩ]
R20  200mΩ  [R1206_200mΩ]
R21  200mΩ  [R1206_200mΩ]
R22  200mΩ  [R1206_200mΩ]
R23  200mΩ  [R1206_200mΩ]
R24  200mΩ  [R1206_200mΩ]
R25  10kΩ  [R0603_10KΩ]
R26  10kΩ  [R0603_10KΩ]
R27  10kΩ  [R0603_10KΩ]
R28  10kΩ  [R10k_KT]
R29  10kΩ  [R10k_KT]
R30  10kΩ  [R10k_KT]
R31  1MΩ  [R0603]
R32  1MΩ  [R0603]
R33  200mΩ  [R1206_200mΩ]
R34  200mΩ  [R1206_200mΩ]
R35  200mΩ  [R1206_200mΩ]
R36  200mΩ  [R1206_200mΩ]
R37  10kΩ  [R0603_10KΩ]
R38  10kΩ  [R0603_10KΩ]
R39  10kΩ  [R10k_KT]
R40  10kΩ  [R10k_KT]
U1  DRV8825PWPR  [DRV8825PWPR]
U2  DRV8825PWPR  [DRV8825PWPR]
U3  DRV8825PWPR  [DRV8825PWPR]
U4  DRV8825PWPR  [DRV8825PWPR]
U5  DRV8825PWPR  [DRV8825PWPR]  (value not drawn)
U6  DRV8825PWPR  [DRV8825PWPR]  (value not drawn)
U7  DRV8825PWPR  [DRV8825PWPR]  (value not drawn)
U8  DRV8825PWPR  [DRV8825PWPR]  (value not drawn)

### Ports
M1D (in), M1FA (in), M1SL (in), M1ST (in), M2D (in), M2FA (in), M2SL (in), M2ST (in), M3D (in), M3FA (in), M3SL (in), M3ST (in), M4D (in), M4FA (in), M4SL (in), M4ST (in), M5D (in), M5FA (in), M5SL (in), M5ST (in), M6D (in), M6FA (in), M6SL (in), M6ST (in), M7D (in), M7FA (in), M7SL (in), M7ST (in), M8D (in), M8FA (in), M8SL (in), M8ST (in), MCU_Vref (in), NEN (in), VM (in)

### Nets
GND: C7.1 C8.1 C9.1 C10.2 C11.2 C12.2 C13.1 C14.1 C15.1 C16.1 C17.1 C18.1 C25.1 C26.1 C27.1 C28.2 C29.2 C30.2 C31.1 C32.1 C33.1 C34.1 C35.1 C36.1 C41.1 C42.1 C43.2 C44.2 C45.1 C46.1 C47.1 C48.1 R4.1 R5.1 R6.1 R7.1 R8.1 R9.1 R13.1 R14.1 R15.1 R19.1 R20.1 R21.1 R22.1 R23.1 R24.1 R28.1 R29.1 R30.1 R33.1 R34.1 R35.1 R36.1 R39.1 R40.1 U1.14(GND) U1.24(MODE0) U1.25(MODE1) U1.26(MODE2) U1.28(GND) U1.29(EP) U2.14(GND) U2.24(MODE0) U2.25(MODE1) U2.26(MODE2) U2.28(GND) U2.29(EP) U3.14(GND) U3.24(MODE0) U3.25(MODE1) U3.26(MODE2) U3.28(GND) U3.29(EP) U4.14(GND) U4.24(MODE0) U4.25(MODE1) U4.26(MODE2) U4.28(GND) U4.29(EP) U5.14(GND) U5.24(MODE0) U5.25(MODE1) U5.26(MODE2) U5.28(GND) U5.29(EP) U6.14(GND) U6.24(MODE0) U6.25(MODE1) U6.26(MODE2) U6.28(GND) U6.29(EP) U7.14(GND) U7.24(MODE0) U7.25(MODE1) U7.26(MODE2) U7.28(GND) U7.29(EP) U8.14(GND) U8.24(MODE0) U8.25(MODE1) U8.26(MODE2) U8.28(GND) U8.29(EP)
VDD_1: C14.2 R10.2 R13.3 U1.15(V3P3OUT)
VDD_2: C15.2 R11.2 R14.3 U2.15(V3P3OUT)
VDD_3: C16.2 R12.2 R15.3 U3.15(V3P3OUT)
VDD_4: C31.2 R25.2 R28.3 U4.15(V3P3OUT)
VDD_5: C32.2 R26.2 R29.3 U5.15(V3P3OUT)
VDD_6: C33.2 R27.2 R30.3 U6.15(V3P3OUT)
VDD_7: C45.2 R37.2 R39.3 U7.15(V3P3OUT)
VDD_8: C46.2 R38.2 R40.3 U8.15(V3P3OUT)
VM: C4.2 C5.2 C6.2 C7.2 C8.2 C9.2 C10.1 C11.1 C12.1 C13.2 C17.2 C18.2 C22.2 C23.2 C24.2 C25.2 C26.2 C27.2 C28.1 C29.1 C30.1 C34.2 C35.2 C36.2 C39.2 C40.2 C41.2 C42.2 C43.1 C44.1 C47.2 C48.2 R1.1 R2.1 R3.1 R16.1 R17.1 R18.1 R31.1 R32.1 U1.4(VMA) U1.11(VMB) U2.4(VMA) U2.11(VMB) U3.4(VMA) U3.11(VMB) U4.4(VMA) U4.11(VMB) U5.4(VMA) U5.11(VMB) U6.4(VMA) U6.11(VMB) U7.4(VMA) U7.11(VMB) U8.4(VMA) U8.11(VMB) ; port VM
M1A1: CN3.4 U1.5(AOUT1)
M1A2: CN3.3 U1.7(AOUT2)
M1B1: CN3.1 U1.10(BOUT1)
M1B2: CN3.2 U1.8(BOUT2)
M1D: U1.20(DIR) ; port M1D
M1FA: R10.1 U1.18(nFAULT) ; port M1FA
M1SL: U1.16(nRESET) U1.17(nSLEEP) ; port M1SL
M1ST: U1.22(STEP) ; port M1ST
M2A1: CN1.4 U2.5(AOUT1)
M2A2: CN1.3 U2.7(AOUT2)
M2B1: CN1.1 U2.10(BOUT1)
M2B2: CN1.2 U2.8(BOUT2)
M2D: U2.20(DIR) ; port M2D
M2FA: R11.1 U2.18(nFAULT) ; port M2FA
M2SL: U2.16(nRESET) U2.17(nSLEEP) ; port M2SL
M2ST: U2.22(STEP) ; port M2ST
M3A1: CN2.4 U3.5(AOUT1)
M3A2: CN2.3 U3.7(AOUT2)
M3B1: CN2.1 U3.10(BOUT1)
M3B2: CN2.2 U3.8(BOUT2)
M3D: U3.20(DIR) ; port M3D
M3FA: R12.1 U3.18(nFAULT) ; port M3FA
M3SL: U3.16(nRESET) U3.17(nSLEEP) ; port M3SL
M3ST: U3.22(STEP) ; port M3ST
M4A1: CN4.4 U4.5(AOUT1)
M4A2: CN4.3 U4.7(AOUT2)
M4B1: CN4.1 U4.10(BOUT1)
M4B2: CN4.2 U4.8(BOUT2)
M4D: U4.20(DIR) ; port M4D
M4FA: R25.1 U4.18(nFAULT) ; port M4FA
M4SL: U4.16(nRESET) U4.17(nSLEEP) ; port M4SL
M4ST: U4.22(STEP) ; port M4ST
M5A1: CN5.4 U5.5(AOUT1)
M5A2: CN5.3 U5.7(AOUT2)
M5B1: CN5.1 U5.10(BOUT1)
M5B2: CN5.2 U5.8(BOUT2)
M5D: U5.20(DIR) ; port M5D
M5FA: R26.1 U5.18(nFAULT) ; port M5FA
M5SL: U5.16(nRESET) U5.17(nSLEEP) ; port M5SL
M5ST: U5.22(STEP) ; port M5ST
M6A1: CN6.4 U6.5(AOUT1)
M6A2: CN6.3 U6.7(AOUT2)
M6B1: CN6.1 U6.10(BOUT1)
M6B2: CN6.2 U6.8(BOUT2)
M6D: U6.20(DIR) ; port M6D
M6FA: R27.1 U6.18(nFAULT) ; port M6FA
M6SL: U6.16(nRESET) U6.17(nSLEEP) ; port M6SL
M6ST: U6.22(STEP) ; port M6ST
M7A1: CN7.4 U7.5(AOUT1)
M7A2: CN7.3 U7.7(AOUT2)
M7B1: CN7.1 U7.10(BOUT1)
M7B2: CN7.2 U7.8(BOUT2)
M7D: U7.20(DIR) ; port M7D
M7FA: R37.1 U7.18(nFAULT) ; port M7FA
M7SL: U7.16(nRESET) U7.17(nSLEEP) ; port M7SL
M7ST: U7.22(STEP) ; port M7ST
M8A1: CN8.4 U8.5(AOUT1)
M8A2: CN8.3 U8.7(AOUT2)
M8B1: CN8.1 U8.10(BOUT1)
M8B2: CN8.2 U8.8(BOUT2)
M8D: U8.20(DIR) ; port M8D
M8FA: R38.1 U8.18(nFAULT) ; port M8FA
M8SL: U8.16(nRESET) U8.17(nSLEEP) ; port M8SL
M8ST: U8.22(STEP) ; port M8ST
MCU_Vref: H1.3 H2.3 H3.3 H4.3 H5.3 H6.3 H7.3 H8.3 ; port MCU_Vref
NEN: U1.21(NENBL) U2.21(NENBL) U3.21(NENBL) U4.21(NENBL) U5.21(NENBL) U6.21(NENBL) U7.21(NENBL) U8.21(NENBL) ; port NEN
R_Vref1: H1.1 R13.2
R_Vref2: H2.1 R14.2
R_Vref3: H3.1 R15.2
R_Vref4: H4.1 R28.2
R_Vref5: H5.1 R29.2
R_Vref6: H6.1 R30.2
R_Vref7: H7.1 R39.2
R_Vref8: H8.1 R40.2
Vref1: H1.2 U1.12(AVREF) U1.13(BVREF)
Vref2: H2.2 U2.12(AVREF) U2.13(BVREF)
Vref3: H3.2 U3.12(AVREF) U3.13(BVREF)
Vref4: H4.2 U4.12(AVREF) U4.13(BVREF)
Vref5: H5.2 U5.12(AVREF) U5.13(BVREF)
Vref6: H6.2 U6.12(AVREF) U6.13(BVREF)
Vref7: H7.2 U7.12(AVREF) U7.13(BVREF)
Vref8: H8.2 U8.12(AVREF) U8.13(BVREF)
NetC1_1: C1.1 U1.2(CP2)
NetC1_2: C1.2 U1.1(CP1)
NetC2_1: C2.1 U2.2(CP2)
NetC2_2: C2.2 U2.1(CP1)
NetC3_1: C3.1 U3.2(CP2)
NetC3_2: C3.2 U3.1(CP1)
NetC4_1: C4.1 R3.2 U1.3(VCP)
NetC5_1: C5.1 R1.2 U2.3(VCP)
NetC6_1: C6.1 R2.2 U3.3(VCP)
NetC19_1: C19.1 U4.2(CP2)
NetC19_2: C19.2 U4.1(CP1)
NetC20_1: C20.1 U5.2(CP2)
NetC20_2: C20.2 U5.1(CP1)
NetC21_1: C21.1 U6.2(CP2)
NetC21_2: C21.2 U6.1(CP1)
NetC22_1: C22.1 R16.2 U4.3(VCP)
NetC23_1: C23.1 R17.2 U5.3(VCP)
NetC24_1: C24.1 R18.2 U6.3(VCP)
NetC37_1: C37.1 U7.2(CP2)
NetC37_2: C37.2 U7.1(CP1)
NetC38_1: C38.1 U8.2(CP2)
NetC38_2: C38.2 U8.1(CP1)
NetC39_1: C39.1 R31.2 U7.3(VCP)
NetC40_1: C40.1 R32.2 U8.3(VCP)
NetR4_2: R4.2 U1.6(ISENA)
NetR5_2: R5.2 U2.6(ISENA)
NetR6_2: R6.2 U3.6(ISENA)
NetR7_2: R7.2 U1.9(ISENB)
NetR8_2: R8.2 U2.9(ISENB)
NetR9_2: R9.2 U3.9(ISENB)
NetR19_2: R19.2 U4.6(ISENA)
NetR20_2: R20.2 U5.6(ISENA)
NetR21_2: R21.2 U6.6(ISENA)
NetR22_2: R22.2 U4.9(ISENB)
NetR23_2: R23.2 U5.9(ISENB)
NetR24_2: R24.2 U6.9(ISENB)
NetR33_2: R33.2 U7.6(ISENA)
NetR34_2: R34.2 U8.6(ISENA)
NetR35_2: R35.2 U7.9(ISENB)
NetR36_2: R36.2 U8.9(ISENB)

Not connected (* = marked no-connect by the designer): U1 19(DECAY)* 23(NC)* 27(nHOME)*; U2 19(DECAY)* 23(NC)* 27(nHOME)*; U3 19(DECAY)* 23(NC)* 27(nHOME)*; U4 19(DECAY)* 23(NC)* 27(nHOME)*; U5 19(DECAY)* 23(NC)* 27(nHOME)*; U6 19(DECAY)* 23(NC)* 27(nHOME)*; U7 19(DECAY)* 23(NC)* 27(nHOME)*; U8 19(DECAY)* 23(NC)* 27(nHOME)*

### Notes on the sheet
- Motor1
- Motor2
- Motor3
- Full step
- (near R10) When returning from sleep mode, approximately 1 ms needs to pass before applying a STEP input
- (near H1) Test if can use DAC to supply reference voltage
- FAULT1 will become down if overheat or overcurrent
- Motor4
- Motor5
- Motor6
- Motor7
- Motor8

### Library data of the parts
C1-C3 C19-C21 C37 C38 = C0603_10nF: 0603电容; Manufacturer: SAMSUNG(三星); Symbol: CC0603KRX7R9BB104; Add into BOM: yes; Tolerance: ±10%; Voltage Rated: 50V; Temperature Coefficient: X7R; Name: 10nF; Device: CC0603KRX7R9BB104; LCSC Part Name: 10nF ±10% 50V; Supplier Part: C100042; Manufacturer Part: CC0603KRX7R9BB104; Supplier Footprint: 0603; JLCPCB Part Class: Basic Part; Datasheet: https://atta.szlcsc.com/upload/public/pdf/source/20180910/C282072_33301C7F631E79921B82A8DAC6BCC5B3.pdf; Supplier: LCSC; Convert to PCB: yes; Value: 10nF
C4-C9 C13 C17 C18 C22-C27 C34-C36 C39-C42 C47 C48 = C0603_100nF: as C67 on sheet 01-MCU; Name: 100nF; Device: CC0603KRX7R9BB104; LCSC Part Name: 100nF ±10% 50V; Supplier Part: C6119867; Manufacturer Part: CC0603KRX7R9BB104; Supplier Footprint: 0603; JLCPCB Part Class: Basic Part; Datasheet: https://atta.szlcsc.com/upload/public/pdf/source/20180910/C282072_33301C7F631E79921B82A8DAC6BCC5B3.pdf; Supplier: LCSC; Convert to PCB: yes; Value: 100nF
C10-C12 C28-C30 C43 C44 = SMD6.3_7.7_100uF: 贴片型铝电解电容 容值 100uF 精度 ±20% 额定电压 35V 纹波电流 87mA@120kHz; Manufacturer: KNSCHA(科尼盛); Symbol: RVT100UF35V67RV0034; Add into BOM: yes; φD: 6.3mm; L: 7.7mm; Lifetime @ Temp: 2000hrs@105℃; Device: RVT100UF35V67RV0034; LCSC Part Name: 100uF ±20% 35V; Supplier Part: C2836442; Manufacturer Part: RVT100UF35V67RV0034; Supplier Footprint: SMD,D6.3xL7.7mm; JLCPCB Part Class: Extended Part; Datasheet: https://atta.szlcsc.com/upload/public/pdf/source/20210528/C2836442_7F6389BF36F63F32D6DF3A507E8E95D6.pdf; Supplier: LCSC; Convert to PCB: yes; Value: 100uF; Tolerance: ±20%; Rated Voltage: 35V; Ripple Current: 87mA@120kHz; Equivalent Series Resistance(ESR): -; Operating Temperature: -55℃~+105℃; Comment_1: 100uF
C14-C16 C31-C33 C45 C46 = C0603_470nF: 0603电容; Manufacturer: SAMSUNG(三星); Symbol: CC0603KRX7R9BB104; Add into BOM: yes; Tolerance: ±10%; Voltage Rated: 25V; Temperature Coefficient: X7R; Name: 470nF; Device: CC0603KRX7R9BB104; LCSC Part Name: 470nF ±10% 25V; Supplier Part: C1623; Manufacturer Part: CC0603KRX7R9BB104; Supplier Footprint: 0603; JLCPCB Part Class: Basic Part; Datasheet: https://atta.szlcsc.com/upload/public/pdf/source/20180910/C282072_33301C7F631E79921B82A8DAC6BCC5B3.pdf; Supplier: LCSC; Convert to PCB: yes; Value: 470nF
CN1-CN8 = ZX-XH2.54-4PZZ: 直插插针; Manufacturer: Megastar(兆星); Add into BOM: yes; Pins Structure: 1x4P; Pitch: 2.54mm; Reference Series: XH; Number of PINs Per Row: 4; Current Rating (Max): 3A; Symbol: ZX-XH2.54-4PZZ; Device: ZX-XH2.54-4PZZ; LCSC Part Name: ZX-XH2.54-4PZZ; Supplier Part: C7429634; Manufacturer Part: ZX-XH2.54-4PZZ; Supplier Footprint: 插件,P=2.54mm; JLCPCB Part Class: Extended Part; Datasheet: https://atta.szlcsc.com/upload/public/pdf/source/20230619/B529A2163E0159A644AB3383D208FB03.pdf; Supplier: LCSC; Convert to PCB: yes; Mounting Style: 直插; Number of Pins: 4P; Number of Rows: 1; Row Spacing: -; Contact Material: 黄铜; Contact Plating: 锡; Operating Temperature Range: -25℃~+85℃; Comment_1: ZX-XH2.54-4PZZ
H1-H8 = HC-1.25-3PLT: 排针3P; Manufacturer: XFCN(兴飞); Symbol: PZ254V-11-03P_C2937625; Add into BOM: yes; Pin Structure: 1x3P; Pitch: 2.54mm; Circluar Pins/Square Pins: 方针; Current Rating (Max): 3A; Voltage Rating (Max): 250V; Device: PZ254V-11-03P; LCSC Part Name: 间距:2.54mm 1x3P 直插 方针; Supplier Part: C2937625; Manufacturer Part: PZ254V-11-03P; Supplier Footprint: 插件,P=2.54mm; JLCPCB Part Class: Extended Part; Datasheet: https://atta.szlcsc.com/upload/public/pdf/source/20200309/C492402_8335C3D49C4E4C618838D59BB1D024C1.pdf; Supplier: LCSC; Convert to PCB: yes; Row Spacing: -; Mounting Type: 直插; Number of Rows: 单排; Number of Pins: 3P; Length of Mating Pin: 6mm; Insulation Height: 2.5mm; Length of End Connection Pin: 3mm; Operating Temperature Range: -40℃~+105℃; Color: 黑色; Comment_1: PZ254V-11-03P
R1-R3 R16-R18 R31 R32 = R0603_1MΩ: as R43 on sheet 01-MCU; Name: 1MΩ; Device: 0603WAF5100T5E; LCSC Part Name: 1MΩ ±1% 100mW 厚膜电阻; Supplier Part: C22935; Manufacturer Part: 0603WAF5100T5E; Supplier Footprint: 0603; JLCPCB Part Class: Basic Part; Datasheet: https://atta.szlcsc.com/upload/public/pdf/source/20200306/C422600_1E6D84923E4A46A82E41ADD87F860B5C.pdf; Supplier: LCSC; Convert to PCB: yes; Type: 厚膜电阻; Value: 1MΩ; Operating Temperature Range: -55℃~+155℃
R4-R9 R19-R24 R33-R36 = R1206_200mΩ: 1206电阻; Manufacturer: UNI-ROYAL(厚声); Symbol: 1206W4F200LT5E; Add into BOM: yes; Tolerance: ±1%; Power(Watts): 250mW; Overload Voltage (Max): 200V; Temperature Coefficient: ±800ppm/℃; Device: 1206W4F200LT5E; LCSC Part Name: 200mΩ ±1% 250mW 厚膜电阻; Supplier Part: C25335; Manufacturer Part: 1206W4F200LT5E; Supplier Footprint: 1206; JLCPCB Part Class: Extended Part; Datasheet: https://atta.szlcsc.com/upload/public/pdf/source/20200306/C422600_1E6D84923E4A46A82E41ADD87F860B5C.pdf; Supplier: LCSC; Convert to PCB: yes; Type: 厚膜电阻; Value: 200mΩ; Operating Temperature Range: -55℃~+155℃; Comment_1: 200mΩ
R10-R12 R25-R27 R37 R38 = R0603_10KΩ: as R44 on sheet 01-MCU; Device: 0603WAF1002T5E; LCSC Part Name: 厚膜电阻 10kΩ ±1% 100mW; Supplier Part: C25804; Manufacturer Part: 0603WAF1002T5E; Supplier Footprint: 0603; JLCPCB Part Class: Basic Part; Datasheet: https://atta.szlcsc.com/upload/public/pdf/source/20200306/C422600_1E6D84923E4A46A82E41ADD87F860B5C.pdf; Supplier: LCSC; Convert to PCB: yes; Type: 厚膜电阻; Value: 10kΩ; Operating Temperature Range: -55℃~+155℃; Comment_1: 10kΩ
R13-R15 R28-R30 R39 R40 = R10k_KT: 可调电阻/电位器   阻值 10kΩ   精度 ±25%   额定电压 -   功率 150mW   温度系数 ±250ppm/℃   圈数 1; Manufacturer: BOURNS; Symbol: TC33X-2-103E; Add into BOM: yes; Turns: 1; Device: TC33X-2-103E; LCSC Part Name: 10kΩ ±25%; Supplier Part: C719176; Manufacturer Part: TC33X-2-103E; Supplier Footprint: SMD-3P,3.8x3.6mm; JLCPCB Part Class: Extended Part; Datasheet: https://atta.szlcsc.com/upload/public/pdf/source/20200810/C720646_BB66A75E654D5E1D30127FF45BCD3C26.pdf; Supplier: LCSC; Convert to PCB: yes; Value: 10kΩ; Tolerance: ±25%; Rated Voltage: -; Power(Watts): 150mW; Temperature Coefficient: ±250ppm/℃; Comment_1: 10kΩ
U1-U8 = DRV8825PWPR: 步进电机驱动芯片; Manufacturer: TI(德州仪器); Add into BOM: yes; Symbol: DRV8825PWPR; Device: DRV8825PWPR; LCSC Part Name: 2.5A 45V电机驱动芯片; Supplier Part: C81582; Manufacturer Part: DRV8825PWPR; Supplier Footprint: HTSSOP-28-EP; JLCPCB Part Class: Extended Part; Datasheet: https://www.ti.com/cn/lit/gpn/drv8825; Supplier: LCSC; Convert to PCB: yes; Comment_1: DRV8825PWPR